# Altium schematic sheet 08_MCU.SchDoc
size 420 x 297 mm; SheetNumber: 8; SheetTotal: 27
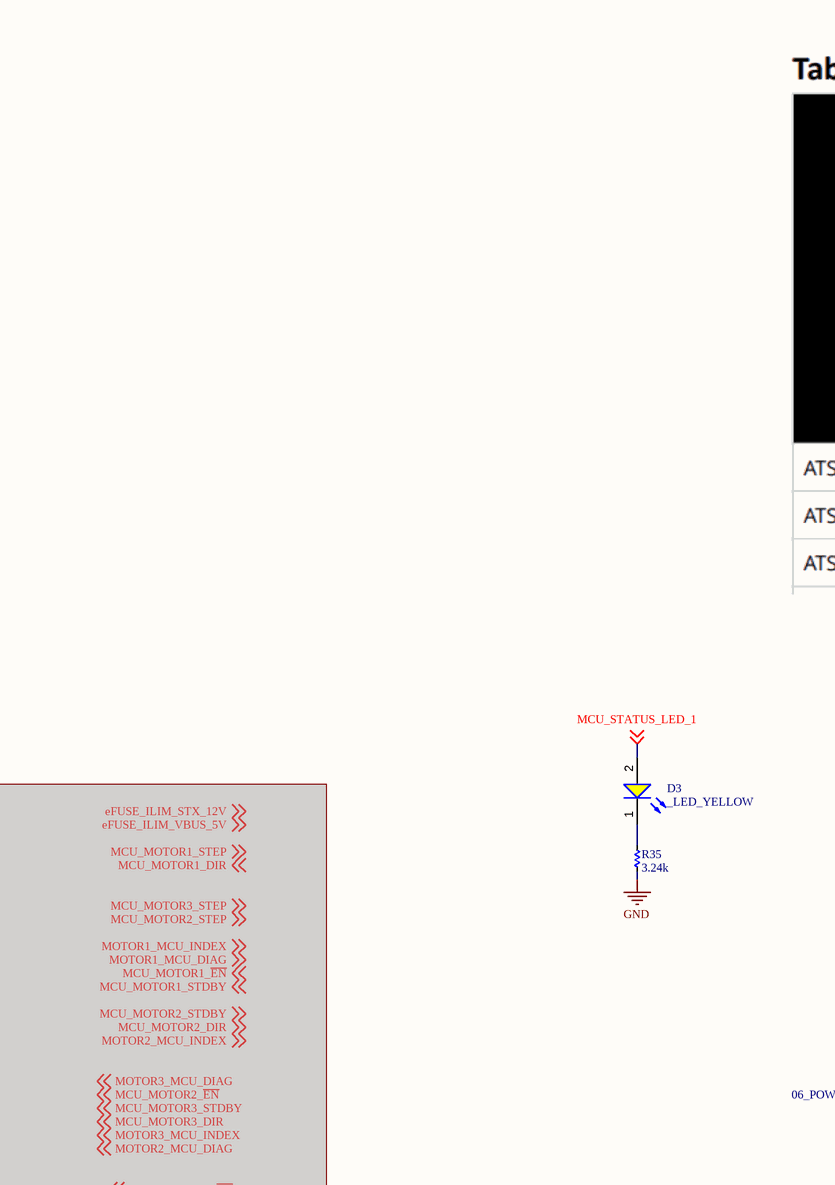
[diagram p0: 08_MCU.SchDoc, top left]
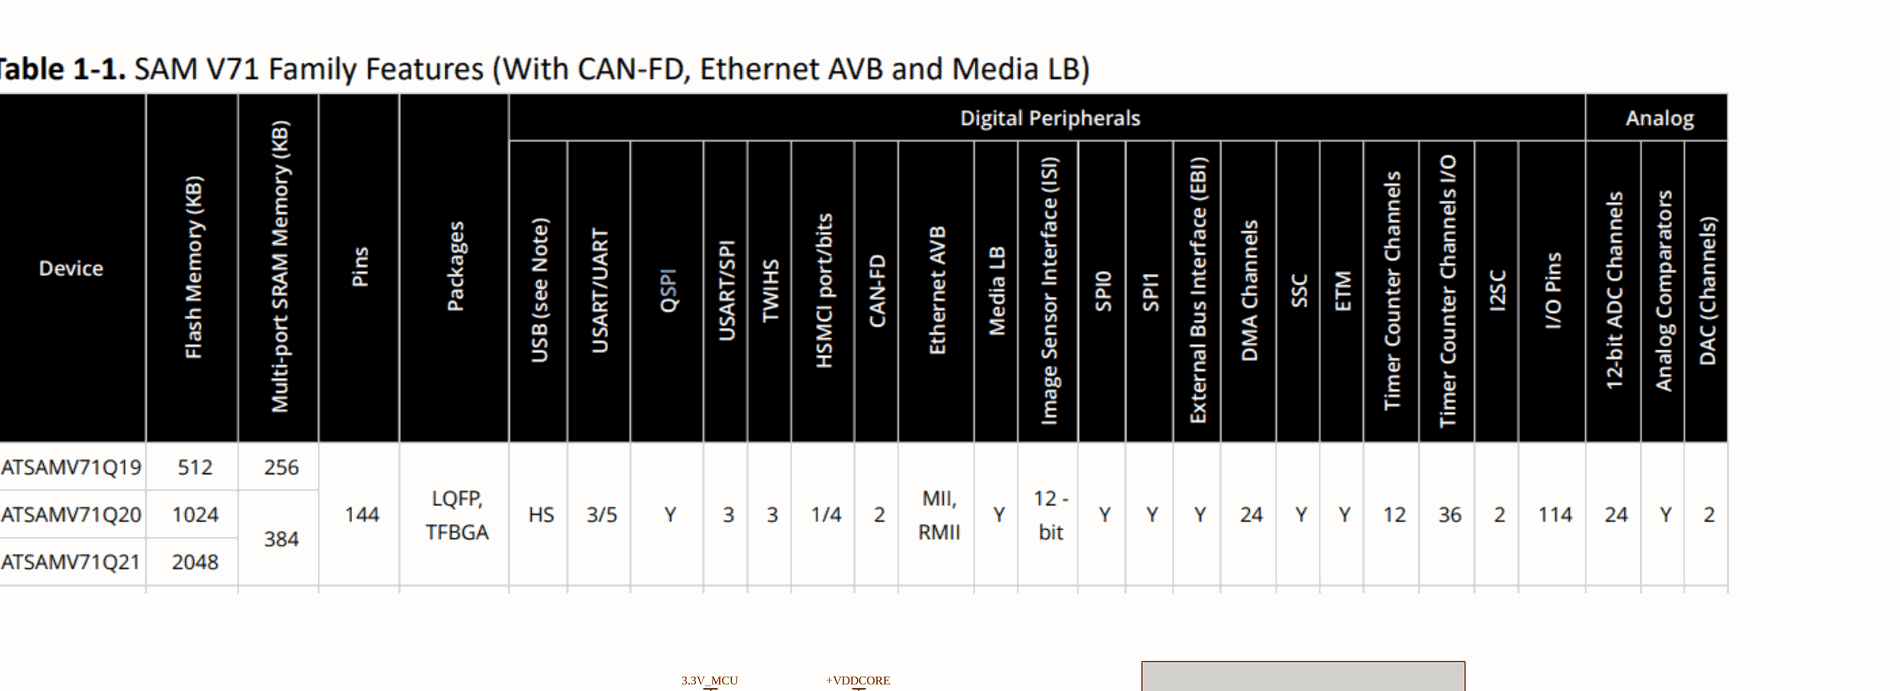
[diagram p1: 08_MCU.SchDoc, top right]
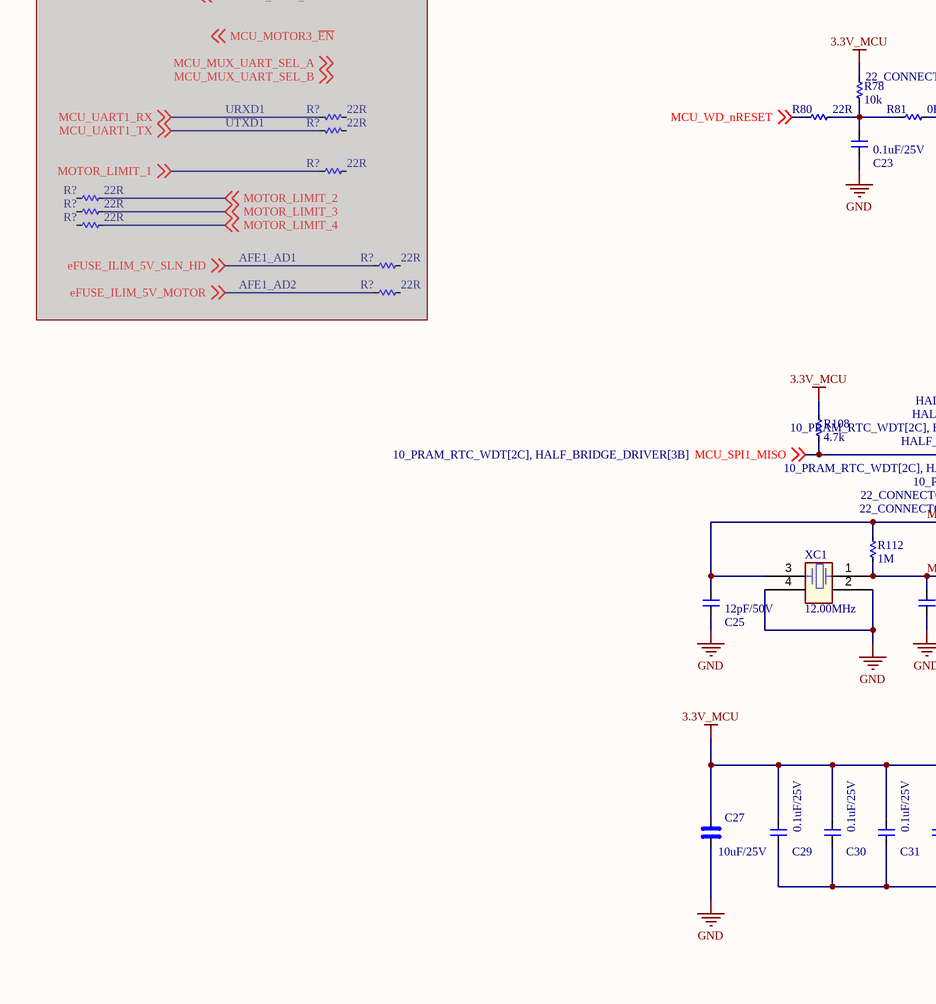
[diagram p2: 08_MCU.SchDoc, bottom left]
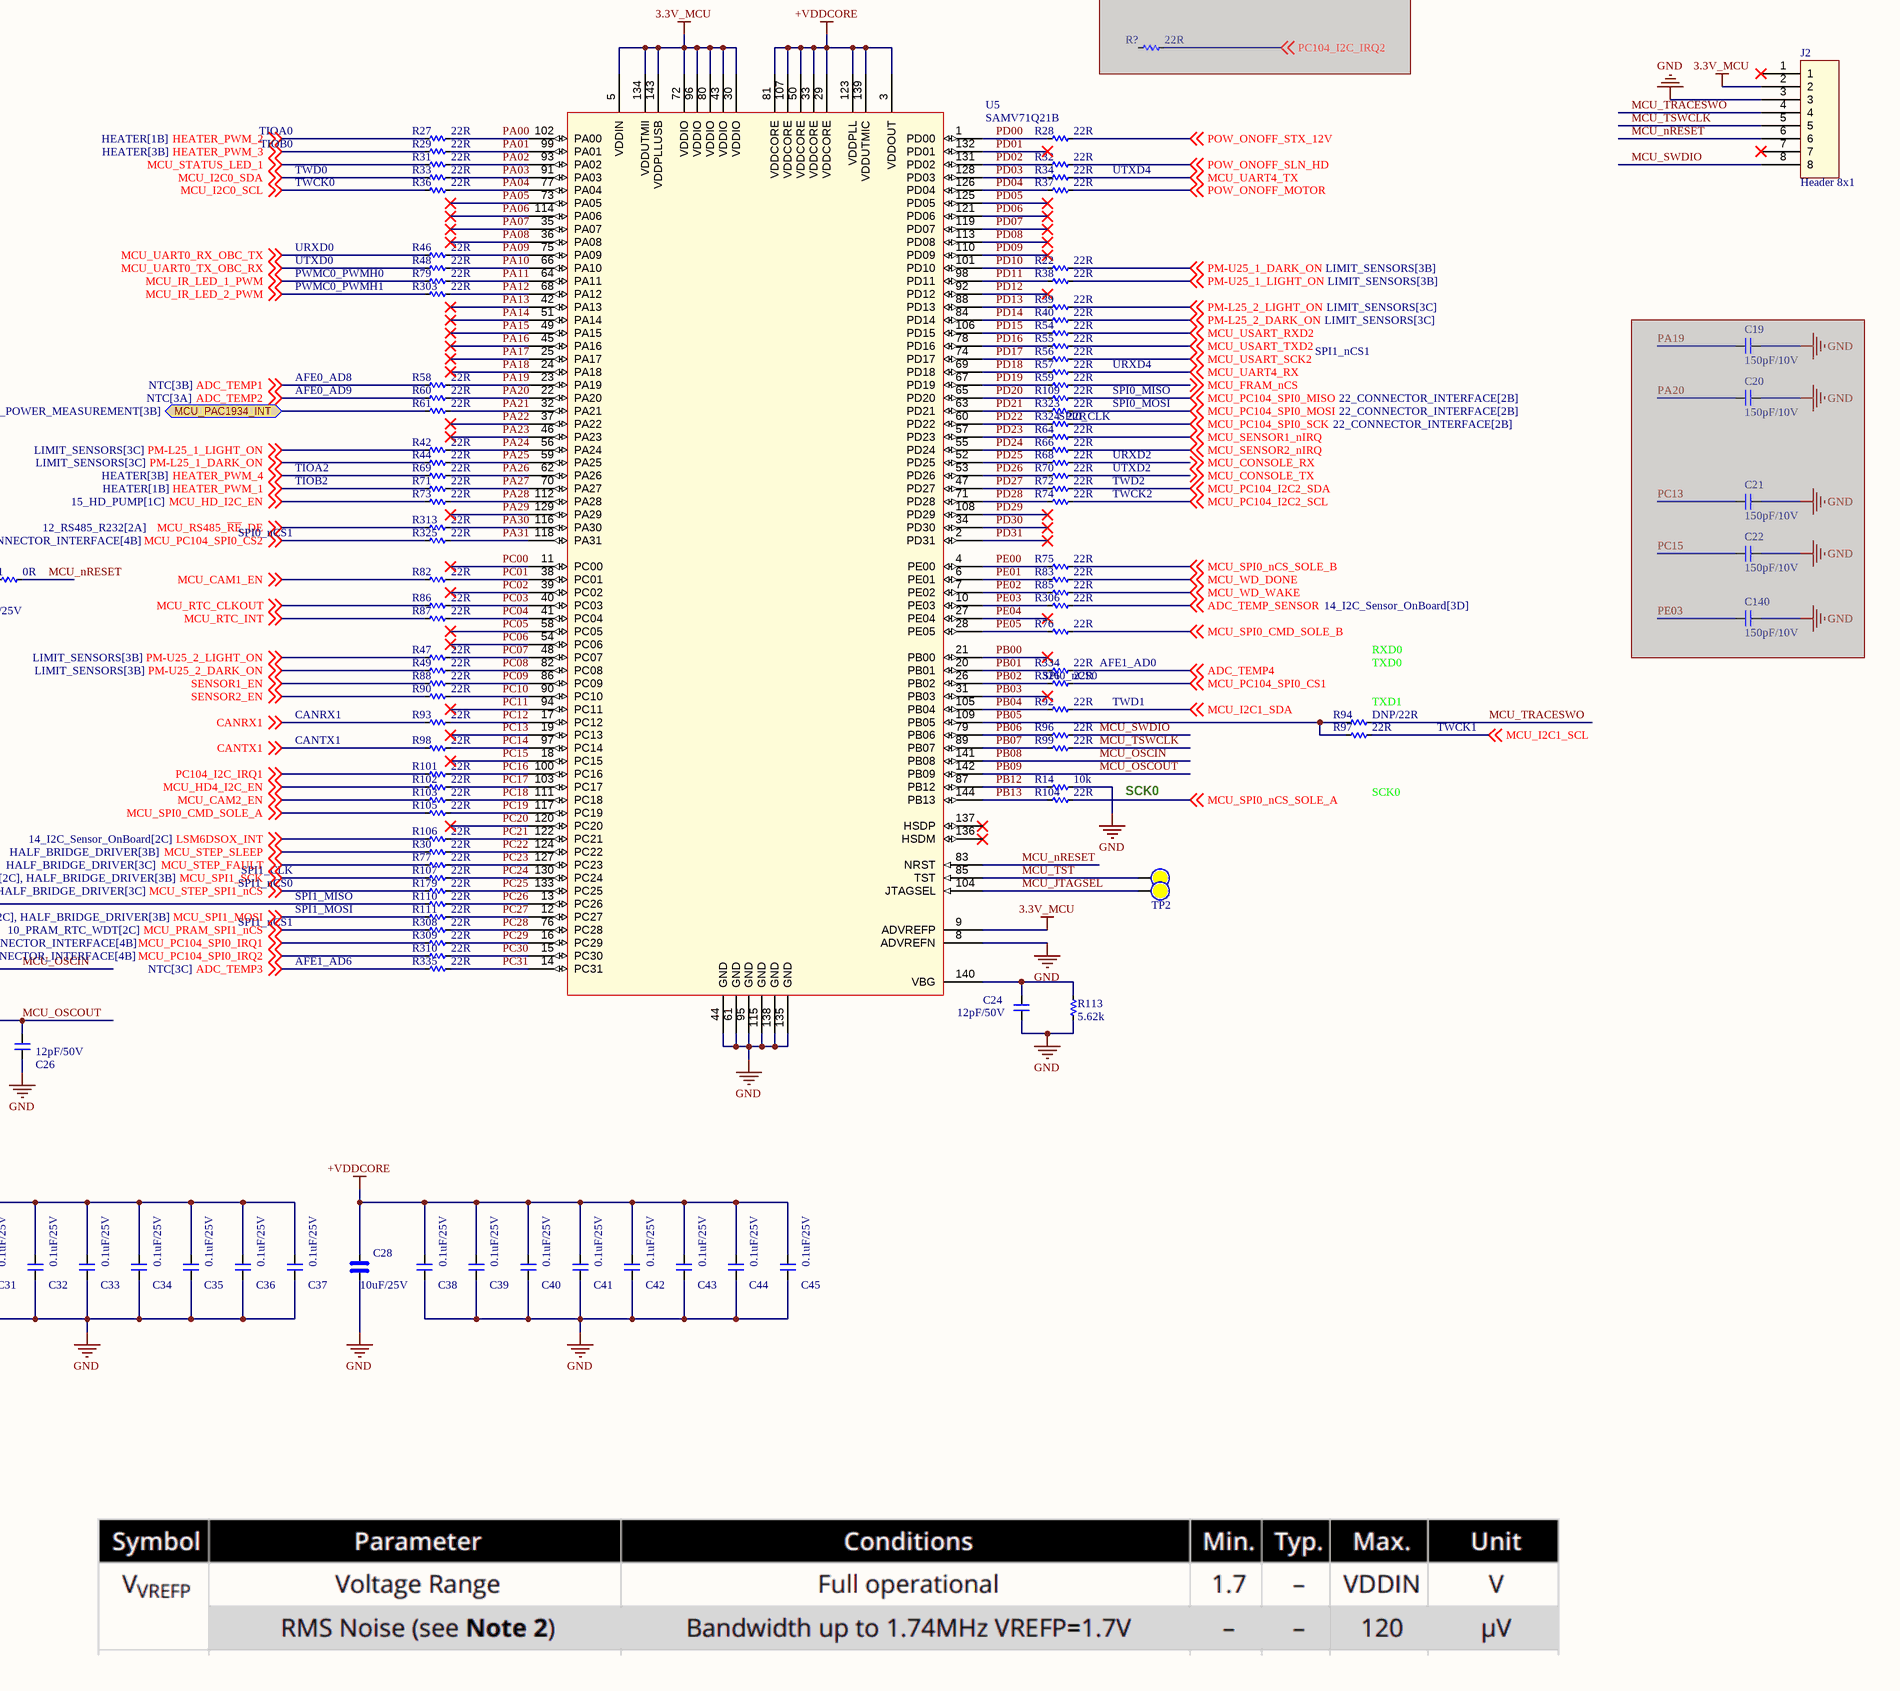
[diagram p3: 08_MCU.SchDoc, bottom right]

## Parts
(Parts that share a designator on the sheet are numbered #1, #2 ... from top to bottom, then left to right.)
C19  150pF/10V  [CAP_C_1005X60]  (masked out: inside a compile mask, not in the netlist)
C20  150pF/10V  [CAP_C_1005X60]  (masked out: inside a compile mask, not in the netlist)
C21  150pF/10V  [CAP_C_1005X60]  (masked out: inside a compile mask, not in the netlist)
C22  150pF/10V  [CAP_C_1005X60]  (masked out: inside a compile mask, not in the netlist)
C23  0.1uF/25V  [CAP_C_1005X60]
C24  12pF/50V  [CAP_C_1005X60]
C25  12pF/50V  [CAP_C_1005X60]
C26  12pF/50V  [CAP_C_1005X60]
C27  10uF/25V  [CAP_C_2012X110]
C28  10uF/25V  [CAP_C_2012X110]
C29  0.1uF/25V  [CAP_C_1005X60]
C30  0.1uF/25V  [CAP_C_1005X60]
C31  0.1uF/25V  [CAP_C_1005X60]
C32  0.1uF/25V  [CAP_C_1005X60]
C33  0.1uF/25V  [CAP_C_1005X60]
C34  0.1uF/25V  [CAP_C_1005X60]
C35  0.1uF/25V  [CAP_C_1005X60]
C36  0.1uF/25V  [CAP_C_1005X60]
C37  0.1uF/25V  [CAP_C_1005X60]
C38  0.1uF/25V  [CAP_C_1005X60]
C39  0.1uF/25V  [CAP_C_1005X60]
C40  0.1uF/25V  [CAP_C_1005X60]
C41  0.1uF/25V  [CAP_C_1005X60]
C42  0.1uF/25V  [CAP_C_1005X60]
C43  0.1uF/25V  [CAP_C_1005X60]
C44  0.1uF/25V  [CAP_C_1005X60]
C45  0.1uF/25V  [CAP_C_1005X60]
C140  150pF/10V  [CAP_C_1005X60]  (masked out: inside a compile mask, not in the netlist)
D3  _LED_YELLOW  [LED_0603]
J2  Header 8x1  [Header_254P_8x1]
R14  10k  [RES_C_1005X40]
R22  22R  [RES_C_1005X40]
R27  22R  [RES_C_1005X40]
R28  22R  [RES_C_1005X40]
R29  22R  [RES_C_1005X40]
R30  22R  [RES_C_1005X40]
R31  22R  [RES_C_1005X40]
R32  22R  [RES_C_1005X40]
R33  22R  [RES_C_1005X40]
R34  22R  [RES_C_1005X40]
R35  3.24k  [RES_C_1005X40]
R36  22R  [RES_C_1005X40]
R37  22R  [RES_C_1005X40]
R38  22R  [RES_C_1005X40]
R39  22R  [RES_C_1005X40]
R40  22R  [RES_C_1005X40]
R42  22R  [RES_C_1005X40]
R44  22R  [RES_C_1005X40]
R46  22R  [RES_C_1005X40]
R47  22R  [RES_C_1005X40]
R48  22R  [RES_C_1005X40]
R49  22R  [RES_C_1005X40]
R54  22R  [RES_C_1005X40]
R55  22R  [RES_C_1005X40]
R56  22R  [RES_C_1005X40]
R57  22R  [RES_C_1005X40]
R58  22R  [RES_C_1005X40]
R59  22R  [RES_C_1005X40]
R60  22R  [RES_C_1005X40]
R61  22R  [RES_C_1005X40]
R64  22R  [RES_C_1005X40]
R66  22R  [RES_C_1005X40]
R68  22R  [RES_C_1005X40]
R69  22R  [RES_C_1005X40]
R70  22R  [RES_C_1005X40]
R71  22R  [RES_C_1005X40]
R72  22R  [RES_C_1005X40]
R73  22R  [RES_C_1005X40]
R74  22R  [RES_C_1005X40]
R75  22R  [RES_C_1005X40]
R76  22R  [RES_C_1005X40]
R77  22R  [RES_C_1005X40]
R78  10k  [RES_C_1005X40]
R79  22R  [RES_C_1005X40]
R80  22R  [RES_C_1005X40]
R81  0R  [RES_C_1005X40]
R82  22R  [RES_C_1005X40]
R83  22R  [RES_C_1005X40]
R85  22R  [RES_C_1005X40]
R86  22R  [RES_C_1005X40]
R87  22R  [RES_C_1005X40]
R88  22R  [RES_C_1005X40]
R90  22R  [RES_C_1005X40]
R92  22R  [RES_C_1005X40]
R93  22R  [RES_C_1005X40]
R94  DNP/22R  [RES_C_1005X40]
R96  22R  [RES_C_1005X40]
R97  22R  [RES_C_1005X40]
R98  22R  [RES_C_1005X40]
R99  22R  [RES_C_1005X40]
R101  22R  [RES_C_1005X40]
R102  22R  [RES_C_1005X40]
R103  22R  [RES_C_1005X40]
R104  22R  [RES_C_1005X40]
R105  22R  [RES_C_1005X40]
R106  22R  [RES_C_1005X40]
R107  22R  [RES_C_1005X40]
R108  4.7k  [RES_C_1005X40]
R109  22R  [RES_C_1005X40]
R110  22R  [RES_C_1005X40]
R111  22R  [RES_C_1005X40]
R112  1M  [RES_C_1005X40]
R113  5.62k  [RES_C_1005X40]
R179  22R  [RES_C_1005X40]
R303  22R  [RES_C_1005X40]
R306  22R  [RES_C_1005X40]
R308  22R  [RES_C_1005X40]
R309  22R  [RES_C_1005X40]
R310  22R  [RES_C_1005X40]
R313  22R  [RES_C_1005X40]
R323  22R  [RES_C_1005X40]
R324  22R  [RES_C_1005X40]
R325  22R  [RES_C_1005X40]
R326  22R  [RES_C_1005X40]
R334  22R  [RES_C_1005X40]
R335  22R  [RES_C_1005X40]
R?#1  22R  [RES_C_1005X40]  (masked out: inside a compile mask, not in the netlist)
R?#2  22R  [RES_C_1005X40]  (masked out: inside a compile mask, not in the netlist)
R?#3  22R  [RES_C_1005X40]  (masked out: inside a compile mask, not in the netlist)
R?#4  22R  [RES_C_1005X40]  (masked out: inside a compile mask, not in the netlist)
R?#5  22R  [RES_C_1005X40]  (masked out: inside a compile mask, not in the netlist)
R?#6  22R  [RES_C_1005X40]  (masked out: inside a compile mask, not in the netlist)
R?#7  22R  [RES_C_1005X40]  (masked out: inside a compile mask, not in the netlist)
R?#8  22R  [RES_C_1005X40]  (masked out: inside a compile mask, not in the netlist)
R?#9  22R  [RES_C_1005X40]  (masked out: inside a compile mask, not in the netlist)
TP1  (no value)  [Testpoint_80]  (no BOM)
TP2  (no value)  [Testpoint_80]  (no BOM)
U5  SAMV71Q21B  [AP6-00118]
XC1  value 12.00MHz  [AP7-00039]  (hidden comment: FC5BQCCMC12.0-T1)

## Ports
MCU_PAC1934_INT (bidir, see 06_POWER_MEASUREMENT[3B])

## Nets
3.3V_MCU: C27.1 C29.2 C30.2 C31.2 C32.2 C33.2 C34.2 C35.2 C36.2 C37.2 J2.2 R78.2 R108.1 U5.5(VDDIN) U5.9(ADVREFP) U5.30(VDDIO) U5.43(VDDIO) U5.72(VDDIO) U5.80(VDDIO) U5.96(VDDIO) U5.134(VDDUTMII) U5.143(VDDPLLUSB)
+VDDCORE: C28.1 C38.2 C39.2 C40.2 C41.2 C42.2 C43.2 C44.2 C45.2 U5.3(VDDOUT) U5.29(VDDCORE) U5.33(VDDCORE) U5.50(VDDCORE) U5.81(VDDCORE) U5.107(VDDCORE) U5.123(VDDPLL) U5.139(VDDUTMIC)
GND: C23.1 C24.1 C25.1 C26.1 C27.2 C28.2 C29.1 C30.1 C31.1 C32.1 C33.1 C34.1 C35.1 C36.1 C37.1 C38.1 C39.1 C40.1 C41.1 C42.1 C43.1 C44.1 C45.1 J2.3 R14.1 R35.2 R113.1 U5.8(ADVREFN) U5.44(GND) U5.61(GND) U5.95(GND) U5.115(GND) U5.135(GND) U5.138(GND) XC1.2 XC1.4
ADC_TEMP1: R58.2 ; off-sheet ADC_TEMP1
ADC_TEMP2: R60.2 ; off-sheet ADC_TEMP2
ADC_TEMP3: R335.2 ; off-sheet ADC_TEMP3
ADC_TEMP4: R334.1 ; off-sheet ADC_TEMP4
ADC_TEMP_SENSOR: R306.1 ; off-sheet ADC_TEMP_SENSOR
CANRX1: R93.2 ; off-sheet CANRX1
CANTX1: R98.2 ; off-sheet CANTX1
HEATER_PWM_1: R71.2 ; off-sheet HEATER_PWM_1
HEATER_PWM_2: R27.2 ; off-sheet HEATER_PWM_2
HEATER_PWM_3: R29.2 ; off-sheet HEATER_PWM_3
HEATER_PWM_4: R69.2 ; off-sheet HEATER_PWM_4
LSM6DSOX_INT: R106.2 ; off-sheet LSM6DSOX_INT
MCU_CAM1_EN: R82.2 ; off-sheet MCU_CAM1_EN
MCU_CAM2_EN: R103.2 ; off-sheet MCU_CAM2_EN
MCU_CONSOLE_RX: R68.1 ; off-sheet MCU_CONSOLE_RX
MCU_CONSOLE_TX: R70.1 ; off-sheet MCU_CONSOLE_TX
MCU_FRAM_nCS: R59.2 ; off-sheet MCU_FRAM_nCS
MCU_HD4_I2C_EN: R102.2 ; off-sheet MCU_HD4_I2C_EN
MCU_HD_I2C_EN: R73.2 ; off-sheet MCU_HD_I2C_EN
MCU_I2C0_SCL: R36.2 ; off-sheet MCU_I2C0_SCL
MCU_I2C0_SDA: R33.2 ; off-sheet MCU_I2C0_SDA
MCU_I2C1_SCL: R97.1 ; off-sheet MCU_I2C1_SCL
MCU_I2C1_SDA: R92.1 ; off-sheet MCU_I2C1_SDA
MCU_IR_LED_1_PWM: R79.2 ; off-sheet MCU_IR_LED_1_PWM
MCU_IR_LED_2_PWM: R303.2 ; off-sheet MCU_IR_LED_2_PWM
MCU_JTAGSEL: TP2.1 U5.104(JTAGSEL)
MCU_nRESET: J2.6 R81.1 U5.83(NRST)
MCU_OSCIN: C25.2 R112.2 U5.141(PB08) XC1.3  [also labelled PB08]
MCU_OSCOUT: C26.2 R112.1 U5.142(PB09) XC1.1  [also labelled PB09]
MCU_PAC1934_INT: R61.2 ; port MCU_PAC1934_INT
MCU_PC104_I2C2_SCL: R74.1 ; off-sheet MCU_PC104_I2C2_SCL
MCU_PC104_I2C2_SDA: R72.1 ; off-sheet MCU_PC104_I2C2_SDA
MCU_PC104_SPI0_CS1: R326.1 ; off-sheet MCU_PC104_SPI0_CS1
MCU_PC104_SPI0_CS2: R325.2 ; off-sheet MCU_PC104_SPI0_CS2
MCU_PC104_SPI0_IRQ1: R309.2 ; off-sheet MCU_PC104_SPI0_IRQ1
MCU_PC104_SPI0_IRQ2: R310.2 ; off-sheet MCU_PC104_SPI0_IRQ2
MCU_PC104_SPI0_MISO: R109.1 ; off-sheet MCU_PC104_SPI0_MISO
MCU_PC104_SPI0_MOSI: R323.1 ; off-sheet MCU_PC104_SPI0_MOSI
MCU_PC104_SPI0_SCK: R324.2 ; off-sheet MCU_PC104_SPI0_SCK
MCU_PRAM_SPI1_nCS: R308.2 ; off-sheet MCU_PRAM_SPI1_nCS
MCU_RS485_~{RE}_DE: R313.2 ; off-sheet MCU_RS485_~{RE}_DE
MCU_RTC_CLKOUT: R86.2 ; off-sheet MCU_RTC_CLKOUT
MCU_RTC_INT: R87.2 ; off-sheet MCU_RTC_INT
MCU_SENSOR1_nIRQ: R64.1 ; off-sheet MCU_SENSOR1_nIRQ
MCU_SENSOR2_nIRQ: R66.1 ; off-sheet MCU_SENSOR2_nIRQ
MCU_SPI0_CMD_SOLE_A: R105.2 ; off-sheet MCU_SPI0_CMD_SOLE_A
MCU_SPI0_CMD_SOLE_B: R76.1 ; off-sheet MCU_SPI0_CMD_SOLE_B
MCU_SPI0_nCS_SOLE_A: R104.1 ; off-sheet MCU_SPI0_nCS_SOLE_A
MCU_SPI0_nCS_SOLE_B: R75.1 ; off-sheet MCU_SPI0_nCS_SOLE_B
MCU_SPI1_MISO: R108.2 R110.2 ; off-sheet MCU_SPI1_MISO
MCU_SPI1_MOSI: R111.2 ; off-sheet MCU_SPI1_MOSI
MCU_SPI1_SCK: R107.2 ; off-sheet MCU_SPI1_SCK
MCU_STATUS_LED_1: D3.2(A) R31.1 ; off-sheet MCU_STATUS_LED_1
MCU_STEP_FAULT: R77.2 ; off-sheet MCU_STEP_FAULT
MCU_STEP_SLEEP: R30.2 ; off-sheet MCU_STEP_SLEEP
MCU_STEP_SPI1_nCS: R179.2 ; off-sheet MCU_STEP_SPI1_nCS
MCU_SWDIO: J2.8 R96.1
MCU_TRACESWO: J2.4 R94.1
MCU_TST: TP1.1 U5.85(TST)
MCU_TSWCLK: J2.5 R99.1
MCU_UART0_RX_OBC_TX: R46.2 ; off-sheet MCU_UART0_RX_OBC_TX
MCU_UART0_TX_OBC_RX: R48.2 ; off-sheet MCU_UART0_TX_OBC_RX
MCU_UART4_RX: R57.1 ; off-sheet MCU_UART4_RX
MCU_UART4_TX: R34.1 ; off-sheet MCU_UART4_TX
MCU_USART_RXD2: R54.1 ; off-sheet MCU_USART_RXD2
MCU_USART_SCK2: R56.1 ; off-sheet MCU_USART_SCK2
MCU_USART_TXD2: R55.1 ; off-sheet MCU_USART_TXD2
MCU_WD_DONE: R83.1 ; off-sheet MCU_WD_DONE
MCU_WD_nRESET: R80.2 ; off-sheet MCU_WD_nRESET
MCU_WD_WAKE: R85.1 ; off-sheet MCU_WD_WAKE
PA00: R27.1 U5.102(PA00)
PA01: R29.1 U5.99(PA01)
PA02: R31.2 U5.93(PA02)
PA03: R33.1 U5.91(PA03)
PA04: R36.1 U5.77(PA04)
PA05: U5.73(PA05)
PA06: U5.114(PA06)
PA07: U5.35(PA07)
PA08: U5.36(PA08)
PA09: R46.1 U5.75(PA09)
PA10: R48.1 U5.66(PA10)
PA11: R79.1 U5.64(PA11)
PA12: R303.1 U5.68(PA12)
PA13: U5.42(PA13)
PA14: U5.51(PA14)
PA15: U5.49(PA15)
PA16: U5.45(PA16)
PA17: U5.25(PA17)
PA18: U5.24(PA18)
PA19: R58.1 U5.23(PA19)
PA20: R60.1 U5.22(PA20)
PA21: R61.1 U5.32(PA21)
PA22: U5.37(PA22)
PA23: U5.46(PA23)
PA24: R42.1 U5.56(PA24)
PA25: R44.1 U5.59(PA25)
PA26: R69.1 U5.62(PA26)
PA27: R71.1 U5.70(PA27)
PA28: R73.1 U5.112(PA28)
PA29: U5.129(PA29)
PA30: R313.1 U5.116(PA30)
PA31: R325.1 U5.118(PA31)
PB00: U5.21(PB00)
PB01: R334.2 U5.20(PB01)
PB02: R326.2 U5.26(PB02)
PB03: U5.31(PB03)
PB04: R92.2 U5.105(PB04)
PB05: R94.2 R97.2 U5.109(PB05)
PB06: R96.2 U5.79(PB06)
PB07: R99.2 U5.89(PB07)
PB12: R14.2 U5.87(PB12)
PB13: R104.2 U5.144(PB13)
PC00: U5.11(PC00)
PC01: R82.1 U5.38(PC01)
PC02: U5.39(PC02)
PC03: R86.1 U5.40(PC03)
PC04: R87.1 U5.41(PC04)
PC05: U5.58(PC05)
PC06: U5.54(PC06)
PC07: R47.1 U5.48(PC07)
PC08: R49.1 U5.82(PC08)
PC09: R88.1 U5.86(PC09)
PC10: R90.1 U5.90(PC10)
PC11: U5.94(PC11)
PC12: R93.1 U5.17(PC12)
PC13: U5.19(PC13)
PC14: R98.1 U5.97(PC14)
PC15: U5.18(PC15)
PC16: R101.1 U5.100(PC16)
PC17: R102.1 U5.103(PC17)
PC18: R103.1 U5.111(PC18)
PC19: R105.1 U5.117(PC19)
PC20: U5.120(PC20)
PC21: R106.1 U5.122(PC21)
PC22: R30.1 U5.124(PC22)
PC23: R77.1 U5.127(PC23)
PC24: R107.1 U5.130(PC24)
PC25: R179.1 U5.133(PC25)
PC26: R110.1 U5.13(PC26)
PC27: R111.1 U5.12(PC27)
PC28: R308.1 U5.76(PC28)
PC29: R309.1 U5.16(PC29)
PC30: R310.1 U5.15(PC30)
PC31: R335.1 U5.14(PC31)
PC104_I2C_IRQ1: R101.2 ; off-sheet PC104_I2C_IRQ1
PD00: R28.2 U5.1(PD00)
PD01: U5.132(PD01)
PD02: R32.2 U5.131(PD02)
PD03: R34.2 U5.128(PD03)
PD04: R37.2 U5.126(PD04)
PD05: U5.125(PD05)
PD06: U5.121(PD06)
PD07: U5.119(PD07)
PD08: U5.113(PD08)
PD09: U5.110(PD09)
PD10: R22.2 U5.101(PD10)
PD11: R38.2 U5.98(PD11)
PD12: U5.92(PD12)
PD13: R39.2 U5.88(PD13)
PD14: R40.2 U5.84(PD14)
PD15: R54.2 U5.106(PD15)
PD16: R55.2 U5.78(PD16)
PD17: R56.2 U5.74(PD17)
PD18: R57.2 U5.69(PD18)
PD19: R59.1 U5.67(PD19)
PD20: R109.2 U5.65(PD20)
PD21: R323.2 U5.63(PD21)
PD22: R324.1 U5.60(PD22)
PD23: R64.2 U5.57(PD23)
PD24: R66.2 U5.55(PD24)
PD25: R68.2 U5.52(PD25)
PD26: R70.2 U5.53(PD26)
PD27: R72.2 U5.47(PD27)
PD28: R74.2 U5.71(PD28)
PD29: U5.108(PD29)
PD30: U5.34(PD30)
PD31: U5.2(PD31)
PE00: R75.2 U5.4(PE00)
PE01: R83.2 U5.6(PE01)
PE02: R85.2 U5.7(PE02)
PE03: R306.2 U5.10(PE03)
PE04: U5.27(PE04)
PE05: R76.2 U5.28(PE05)
PM-L25_1_DARK_ON: R44.2 ; off-sheet PM-L25_1_DARK_ON
PM-L25_1_LIGHT_ON: R42.2 ; off-sheet PM-L25_1_LIGHT_ON
PM-L25_2_DARK_ON: R40.1 ; off-sheet PM-L25_2_DARK_ON
PM-L25_2_LIGHT_ON: R39.1 ; off-sheet PM-L25_2_LIGHT_ON
PM-U25_1_DARK_ON: R22.1 ; off-sheet PM-U25_1_DARK_ON
PM-U25_1_LIGHT_ON: R38.1 ; off-sheet PM-U25_1_LIGHT_ON
PM-U25_2_DARK_ON: R49.2 ; off-sheet PM-U25_2_DARK_ON
PM-U25_2_LIGHT_ON: R47.2 ; off-sheet PM-U25_2_LIGHT_ON
POW_ONOFF_MOTOR: R37.1 ; off-sheet POW_ONOFF_MOTOR
POW_ONOFF_SLN_HD: R32.1 ; off-sheet POW_ONOFF_SLN_HD
POW_ONOFF_STX_12V: R28.1 ; off-sheet POW_ONOFF_STX_12V
SENSOR1_EN: R88.2 ; off-sheet SENSOR1_EN
SENSOR2_EN: R90.2 ; off-sheet SENSOR2_EN
NetC23_2: C23.2 R78.1 R80.1 R81.2
NetC24_2: C24.2 R113.2 U5.140(VBG)
NetD3_1: D3.1(K) R35.1

Not connected (* = marked no-connect by the designer): J2 1* 7*; U5 136(HSDM)* 137(HSDP)*

## Notes on the sheet
- TIOA0
- TWD0
- TWCK0
- TIOB0
- UTXD4
- URXD0
- UTXD0
- PWMC0_PWMH0
- PWMC0_PWMH1
- AFE0_AD8
- AFE0_AD9
- URXD4
- SPI0_MISO
- SPI1_nCS1
- URXD2
- SPI0_MOSI
- SPI0_CLK
- TIOB2
- TIOA2
- TWD2
- TWCK2
- UTXD2
- URXD1
- UTXD1
- SPI0_nCS1
- RXD0
- AFE1_AD1
- CANRX1
- SPI0_nCS0
- AFE1_AD0
- TWD1
- TXD0
- (near R94) TXD1
- AFE1_AD2
- CANTX1
- TWCK1
- SCK0
- SPI1_MISO
- SPI1_MOSI
- SPI1_CLK
- SPI1_nCS0
- AFE1_AD6
- Project
- Sub-system:
- Design by:
- Sheet title:
- Sheet:
- of
- Checked by:
- Approved by:
- Doc no:
- Revision
- Size:
- Date:

## Library data of the parts
C19-C26 C29-C45 C140 = _CAP_C_2: CAP
C27 C28 = _CAP_C_High_2: CAP High Value
R14 R22 R27-R40 R42 R44 R46-R49 R54-R61 R64 R66 R68-R83 R85-R88 R90 R92-R94 R96-R99 R101-R113 R179 R303 R306 R308-R310 R313 R323-R326 R334 R335 R?#1-R?#9 = _RES_B_2: RES
TP1 TP2 = Test Point: Solder: NF
U5 = SAMV71Q21B: SAM 32-bit ARM Cortex-M* RISC MCU, SAMV71B Series, QFP144; PartGroup: Integrated Circuits,MCU, MPU, DSP,ARM MCU; Manufacturer: MICROCHIP; MPN: ATSAMV71Q21B-AAB; AN: A06-1541; TemperatureRange: -40Â°C to +105Â°C; Height: 1,60000002384186; Value: SAMV71Q21B
XC1 = A07-0042: Fox FQ5032B 12.0MHz SMD crystal 738B-12; PartGroup: Frequency devices,Crystals,SMD; Manufacturer: Fox  Electronics; MPN: FQ5032B-12.000; Tolerance: Â±30ppm; TemperatureRange: 0Â°C ~ 70Â°C; AN: A07-0042; Height: 1,20000004768372